# Altium schematic sheet 11 Proc Pwr1.SchDoc
size 420 x 297 mm
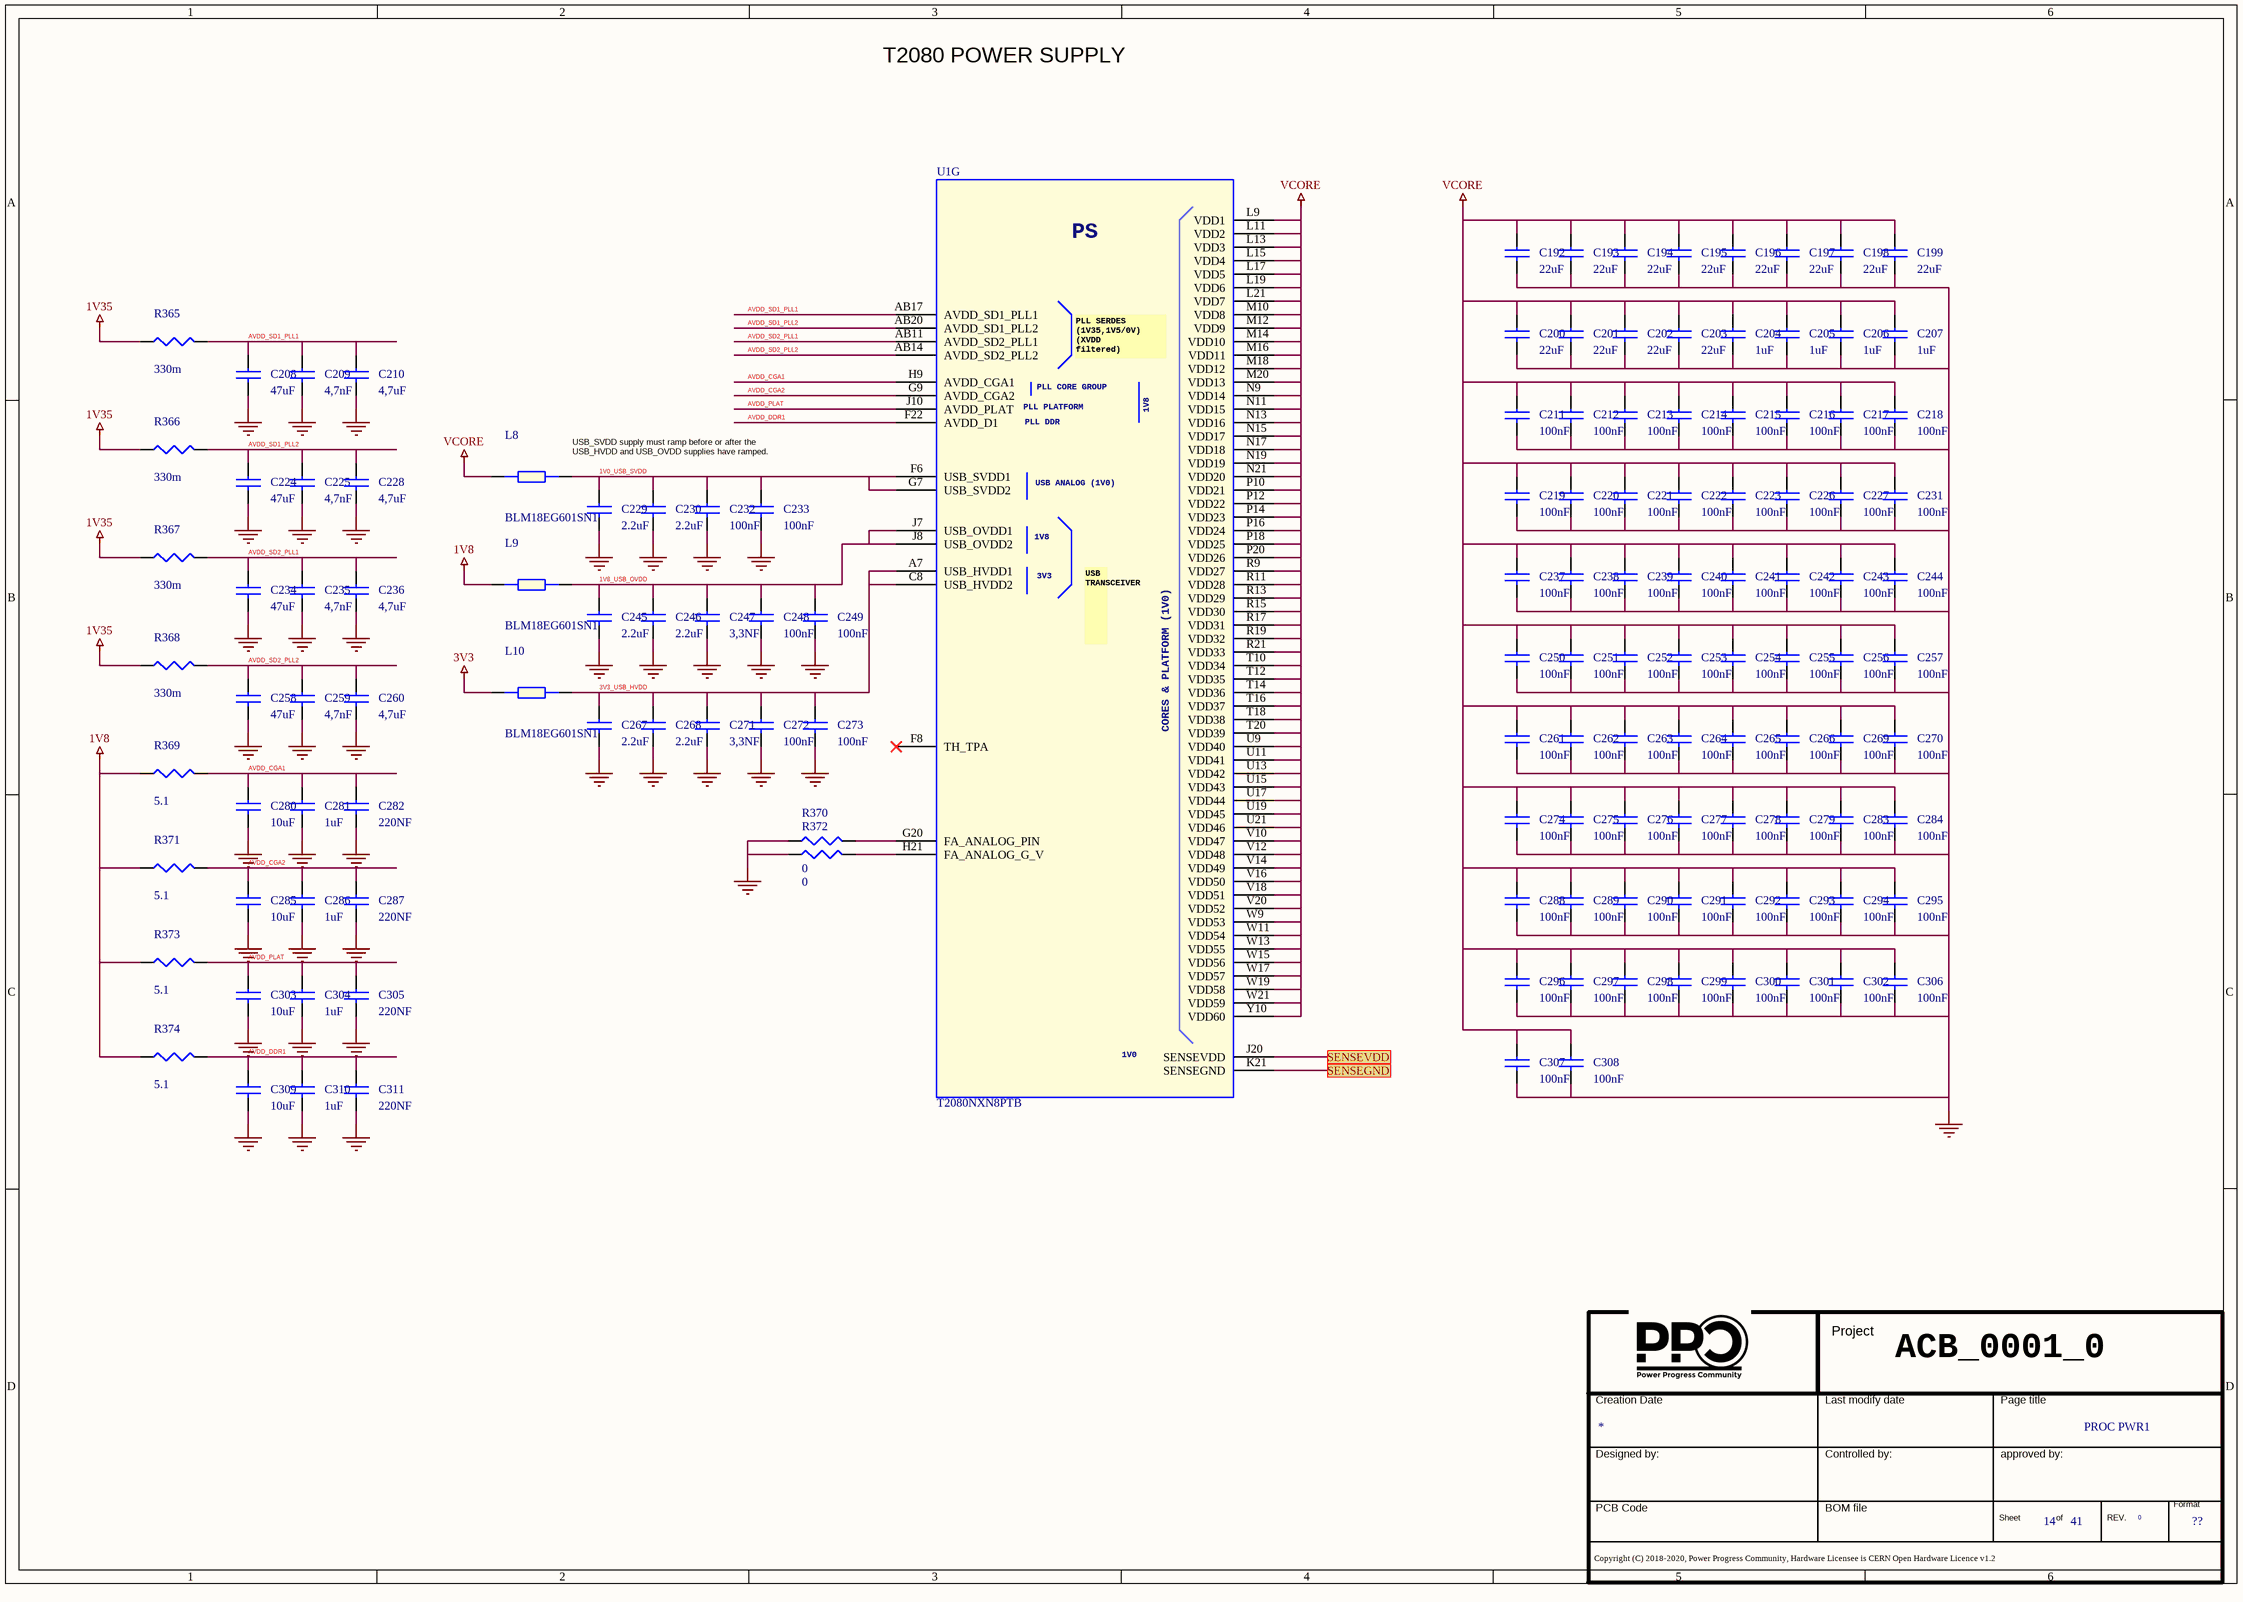
[diagram p0: 11 Proc Pwr1.SchDoc]

## Parts
*  Doc: PROC PWR1  Page Count: 41  Page Number: 14  Page Size: ??  RevCode: 0  (hidden comment: Title_block_PPC)  (graphical)
C192  22uF  [SMD_0805]
C193  22uF  [SMD_0805]
C194  22uF  [SMD_0805]
C195  22uF  [SMD_0805]
C196  22uF  [SMD_0805]
C197  22uF  [SMD_0805]
C198  22uF  [SMD_0805]
C199  22uF  [SMD_0805]
C200  22uF  [SMD_0805]
C201  22uF  [SMD_0805]
C202  22uF  [SMD_0805]
C203  22uF  [SMD_0805]
C204  1uF  [SMD_0402]
C205  1uF  [SMD_0402]
C206  1uF  [SMD_0402]
C207  1uF  [SMD_0402]
C208  47uF  [SMD_0805]
C209  4,7nF  [SMD_0402]
C210  4,7uF  [SMD_0603]
C211  100nF  [SMD_0603]
C212  100nF  [SMD_0603]
C213  100nF  [SMD_0201]
C214  100nF  [SMD_0603]
C215  100nF  [SMD_0603]
C216  100nF  [SMD_0603]
C217  100nF  [SMD_0603]
C218  100nF  [SMD_0603]
C219  100nF  [SMD_0201]
C220  100nF  [SMD_0201]
C221  100nF  [SMD_0603]
C222  100nF  [SMD_0201]
C223  100nF  [SMD_0201]
C224  47uF  [SMD_0805]
C225  4,7nF  [SMD_0402]
C226  100nF  [SMD_0603]
C227  100nF  [SMD_0603]
C228  4,7uF  [SMD_0603]
C229  2.2uF  [SMD_0402]
C230  2.2uF  [SMD_0402]
C231  100nF  [SMD_0603]
C232  100nF  [SMD_0603]
C233  100nF  [SMD_0603]
C234  47uF  [SMD_0805]
C235  4,7nF  [SMD_0402]
C236  4,7uF  [SMD_0603]
C237  100nF  [SMD_0201]
C238  100nF  [SMD_0201]
C239  100nF  [SMD_0201]
C240  100nF  [SMD_0201]
C241  100nF  [SMD_0201]
C242  100nF  [SMD_0201]
C243  100nF  [SMD_0201]
C244  100nF  [SMD_0201]
C245  2.2uF  [SMD_0402]
C246  2.2uF  [SMD_0402]
C247  3,3NF  [SMD_0402]
C248  100nF  [SMD_0603]
C249  100nF  [SMD_0603]
C250  100nF  [SMD_0201]
C251  100nF  [SMD_0201]
C252  100nF  [SMD_0201]
C253  100nF  [SMD_0201]
C254  100nF  [SMD_0201]
C255  100nF  [SMD_0201]
C256  100nF  [SMD_0201]
C257  100nF  [SMD_0201]
C258  47uF  [SMD_0805]
C259  4,7nF  [SMD_0402]
C260  4,7uF  [SMD_0603]
C261  100nF  [SMD_0201]
C262  100nF  [SMD_0201]
C263  100nF  [SMD_0201]
C264  100nF  [SMD_0201]
C265  100nF  [SMD_0201]
C266  100nF  [SMD_0201]
C267  2.2uF  [SMD_0402]
C268  2.2uF  [SMD_0402]
C269  100nF  [SMD_0201]
C270  100nF  [SMD_0201]
C271  3,3NF  [SMD_0402]
C272  100nF  [SMD_0603]
C273  100nF  [SMD_0603]
C274  100nF  [SMD_0201]
C275  100nF  [SMD_0201]
C276  100nF  [SMD_0201]
C277  100nF  [SMD_0201]
C278  100nF  [SMD_0201]
C279  100nF  [SMD_0201]
C280  10uF  [SMD_0603]
C281  1uF  [SMD_0402]
C282  220NF  [SMD_0402]
C283  100nF  [SMD_0201]
C284  100nF  [SMD_0201]
C285  10uF  [SMD_0603]
C286  1uF  [SMD_0402]
C287  220NF  [SMD_0402]
C288  100nF  [SMD_0201]
C289  100nF  [SMD_0201]
C290  100nF  [SMD_0201]
C291  100nF  [SMD_0201]
C292  100nF  [SMD_0201]
C293  100nF  [SMD_0201]
C294  100nF  [SMD_0201]
C295  100nF  [SMD_0201]
C296  100nF  [SMD_0201]
C297  100nF  [SMD_0201]
C298  100nF  [SMD_0201]
C299  100nF  [SMD_0201]
C300  100nF  [SMD_0201]
C301  100nF  [SMD_0201]
C302  100nF  [SMD_0201]
C303  10uF  [SMD_0603]
C304  1uF  [SMD_0402]
C305  220NF  [SMD_0402]
C306  100nF  [SMD_0201]
C307  100nF  [SMD_0201]
C308  100nF  [SMD_0201]
C309  10uF  [SMD_0603]
C310  1uF  [SMD_0402]
C311  220NF  [SMD_0402]
L8  BLM18EG601SN1  [SMD_0603]
L9  BLM18EG601SN1  [SMD_0603]
L10  BLM18EG601SN1  [SMD_0603]
R365  330m  [SMD_0402]
R366  330m  [SMD_0402]
R367  330m  [SMD_0402]
R368  330m  [SMD_0402]
R369  5.1  [SMD_0402]
R370  0  [SMD_0402]
R371  5.1  [SMD_0402]
R372  0  [SMD_0402]
R373  5.1  [SMD_0402]
R374  5.1  [SMD_0402]
U1  T2080NXN8PTB  [bga]  (part G of 14)

## Ports
SENSEGND, SENSEVDD

## Nets
1V8: L9.1 R369.1 R371.1 R373.1 R374.1
1V35: R365.1 R366.1 R367.1 R368.1
3V3: L10.1
GND: C192.2 C193.2 C194.2 C195.2 C196.2 C197.2 C198.2 C199.2 C200.2 C201.2 C202.2 C203.2 C204.2 C205.2 C206.2 C207.2 C208.2 C209.2 C210.2 C211.2 C212.2 C213.2 C214.2 C215.2 C216.2 C217.2 C218.2 C219.2 C220.2 C221.2 C222.2 C223.2 C224.2 C225.2 C226.2 C227.2 C228.2 C229.2 C230.2 C231.2 C232.2 C233.2 C234.2 C235.2 C236.2 C237.2 C238.2 C239.2 C240.2 C241.2 C242.2 C243.2 C244.2 C245.2 C246.2 C247.2 C248.2 C249.2 C250.2 C251.2 C252.2 C253.2 C254.2 C255.2 C256.2 C257.2 C258.2 C259.2 C260.2 C261.2 C262.2 C263.2 C264.2 C265.2 C266.2 C267.2 C268.2 C269.2 C270.2 C271.2 C272.2 C273.2 C274.2 C275.2 C276.2 C277.2 C278.2 C279.2 C280.2 C281.2 C282.2 C283.2 C284.2 C285.2 C286.2 C287.2 C288.2 C289.2 C290.2 C291.2 C292.2 C293.2 C294.2 C295.2 C296.2 C297.2 C298.2 C299.2 C300.2 C301.2 C302.2 C303.2 C304.2 C305.2 C306.2 C307.2 C308.2 C309.2 C310.2 C311.2 R370.1 R372.1
VCORE: C192.1 C193.1 C194.1 C195.1 C196.1 C197.1 C198.1 C199.1 C200.1 C201.1 C202.1 C203.1 C204.1 C205.1 C206.1 C207.1 C211.1 C212.1 C213.1 C214.1 C215.1 C216.1 C217.1 C218.1 C219.1 C220.1 C221.1 C222.1 C223.1 C226.1 C227.1 C231.1 C237.1 C238.1 C239.1 C240.1 C241.1 C242.1 C243.1 C244.1 C250.1 C251.1 C252.1 C253.1 C254.1 C255.1 C256.1 C257.1 C261.1 C262.1 C263.1 C264.1 C265.1 C266.1 C269.1 C270.1 C274.1 C275.1 C276.1 C277.1 C278.1 C279.1 C283.1 C284.1 C288.1 C289.1 C290.1 C291.1 C292.1 C293.1 C294.1 C295.1 C296.1 C297.1 C298.1 C299.1 C300.1 C301.1 C302.1 C306.1 C307.1 C308.1 L8.1 U1.L9(VDD1) U1.L11(VDD2) U1.L13(VDD3) U1.L15(VDD4) U1.L17(VDD5) U1.L19(VDD6) U1.L21(VDD7) U1.M10(VDD8) U1.M12(VDD9) U1.M14(VDD10) U1.M16(VDD11) U1.M18(VDD12) U1.M20(VDD13) U1.N9(VDD14) U1.N11(VDD15) U1.N13(VDD16) U1.N15(VDD17) U1.N17(VDD18) U1.N19(VDD19) U1.N21(VDD20) U1.P10(VDD21) U1.P12(VDD22) U1.P14(VDD23) U1.P16(VDD24) U1.P18(VDD25) U1.P20(VDD26) U1.R9(VDD27) U1.R11(VDD28) U1.R13(VDD29) U1.R15(VDD30) U1.R17(VDD31) U1.R19(VDD32) U1.R21(VDD33) U1.T10(VDD34) U1.T12(VDD35) U1.T14(VDD36) U1.T16(VDD37) U1.T18(VDD38) U1.T20(VDD39) U1.U9(VDD40) U1.U11(VDD41) U1.U13(VDD42) U1.U15(VDD43) U1.U17(VDD44) U1.U19(VDD45) U1.U21(VDD46) U1.V10(VDD47) U1.V12(VDD48) U1.V14(VDD49) U1.V16(VDD50) U1.V18(VDD51) U1.V20(VDD52) U1.W9(VDD53) U1.W11(VDD54) U1.W13(VDD55) U1.W15(VDD56) U1.W17(VDD57) U1.W19(VDD58) U1.W21(VDD59) U1.Y10(VDD60)
1V0_USB_SVDD: C229.1 C230.1 C232.1 C233.1 L8.2 U1.F6(USB_SVDD1) U1.G7(USB_SVDD2)
1V8_USB_OVDD: C245.1 C246.1 C247.1 C248.1 C249.1 L9.2 U1.J7(USB_OVDD1) U1.J8(USB_OVDD2)
3V3_USB_HVDD: C267.1 C268.1 C271.1 C272.1 C273.1 L10.2 U1.A7(USB_HVDD1) U1.C8(USB_HVDD2)
AVDD_CGA1: C280.1 C281.1 C282.1 R369.2 U1.H9(AVDD_CGA1)
AVDD_CGA2: C285.1 C286.1 C287.1 R371.2 U1.G9(AVDD_CGA2)
AVDD_DDR1: C309.1 C310.1 C311.1 R374.2 U1.F22(AVDD_D1)
AVDD_PLAT: C303.1 C304.1 C305.1 R373.2 U1.J10(AVDD_PLAT)
AVDD_SD1_PLL1: C208.1 C209.1 C210.1 R365.2 U1.AB17(AVDD_SD1_PLL1)
AVDD_SD1_PLL2: C224.1 C225.1 C228.1 R366.2 U1.AB20(AVDD_SD1_PLL2)
AVDD_SD2_PLL1: C234.1 C235.1 C236.1 R367.2 U1.AB11(AVDD_SD2_PLL1)
AVDD_SD2_PLL2: C258.1 C259.1 C260.1 R368.2 U1.AB14(AVDD_SD2_PLL2)
SENSEGND: U1.K21(SENSEGND) ; port SENSEGND
SENSEVDD: U1.J20(SENSEVDD) ; port SENSEVDD
NetR370_2: R370.2 U1.G20(FA_ANALOG_PIN)
NetR372_2: R372.2 U1.H21(FA_ANALOG_G_V)

Not connected (* = marked no-connect by the designer): U1 F8(TH_TPA)*

## Notes on the sheet
- T2080 POWER SUPPLY
- (near L8) USB_SVDD supply must ramp before or after the
  USB_HVDD and USB_OVDD supplies have ramped.
- ACB_0001_0
- (in symbol T2080, part G) PS; PLL SERDES / (1V35,1V5/0V) / (XVDD / filtered); PLL CORE GROUP; PLL PLATFORM; 1V8; PLL DDR; USB ANALOG (1V0); 3V3; USB / TRANSCEIVER; CORES & PLATFORM (1V0); 1V0
- (in symbol Title_block_PPC) Project; Creation Date; Last modify date; Page title; Designed by:; Controlled by:; approved by:; Format; PCB Code; BOM file; Sheet; of; REV.; Copyright (C) 2018-2020, Power Progress Community, Hardware Licensee is CERN Open Hardware Licence v1.2

## Library data of the parts
* = Title_block_PPC: Title: T2080PCIe; Schematic Page Count: 45; Schematic Page Number: 16; Author: MICETEK; Page Create Date: March  8, 1995; Page Title: ?; Page Modify Date: *
C192-C203 = CAP NP_Dup2: 22UF 35V 20% 0805; Manufacturer Part Number 1: C2012X5R1V226M125AC; Manufacturer 1: TDK; Part Number: PASSIVE_224; RSM: RC0805; PCB Footprint: SMD_0805; Part Type: Capacitors\Ceramic\SMD\0805
C204-C207 C281 C286 C304 C310 = CAP NP_Dup2: CAP CER 1UF 25V X6S 0402; Manufacturer Part Number 1: GRM155C81E105KE11D; Manufacturer 1: Murata; Part Number: PASSIVE_1446; RSM: RC0402; PCB Footprint: SMD_0402; Part Type: Capacitors\Ceramic\SMD\0402
C208 C224 C234 C258 = CAP NP_Dup2: CAP CER 47UF 10V 20% X5R 0805; Manufacturer Part Number 1: JMK212BJ476MG-T; Manufacturer 1: Taiyo Yuden; Part Number: PASSIVE_244; RSM: RC0805; PCB Footprint: SMD_0805; Part Type: Capacitors\Ceramic\SMD\0805
C209 C225 C235 C259 = CAP NP_Dup2: COND.CER. 4,7nF 50V 0402 X7R SMD; Manufacturer Part Number 1: GRM155R71H472KA01D; Manufacturer 1: Murata; Part Number: PASSIVE_78; RSM: RC0402; PCB Footprint: SMD_0402; Part Type: Capacitors\Ceramic\SMD\0402
C210 C228 C236 C260 = CAP NP_Dup2: COND.CER.4,7uF 16V X5R 0603 SMD; Manufacturer Part Number 1: CL10A475KO8NNNC; Manufacturer 1: SAMSUNG; Part Number: PASSIVE_1405; RSM: RC0603; PCB Footprint: SMD_0603; Part Type: Capacitors\Ceramic\SMD\0603
C211 C212 C214-C218 C221 C226 C227 C231-C233 C248 C249 C272 C273 = CAP NP_Dup2: COND.CER.100NF 50V 0603 X7R SMD; Manufacturer Part Number 1: ECJ1VB1H104K; Manufacturer 1: PANASONIC; Part Number: PASSIVE_118; RSM: RC0603; PCB Footprint: SMD_0603; Part Type: Capacitors\Ceramic\SMD\0603
C213 C219 C220 C237-C244 C253-C257 C261-C266 C269 C270 = CAP NP_Dup2: CAP CER 0.1UF 6.3V 20% X5R 0201; Manufacturer Part Number 1: C0603X5R0J104M030BC; Manufacturer 1: TDK; Part Number: PASSIVE_3; RSM: RC0201; PCB Footprint: SMD_0201; Part Type: Capacitors\Ceramic\SMD\0201
C222 C223 C250-C252 C274-C279 C283 C284 C288-C302 C306-C308 = CAP NP_Dup2: LCC - SMD/SMT 0201 0.1uF 10volts X7S +/-10%; Part Number: PASSIVE_2; Manufacturer 1: TDK; Manufacturer Part Number 1: C0603X7S1A104K030BC; RSM: RC0201; Part Type: Capacitors\Ceramic\SMD\0201; PCB Footprint: SMD_0201
C229 C230 C245 C246 C267 C268 = CAP NP_Dup2: CAP CER 2.2UF 25V X5R 0402; Manufacturer Part Number 1: GRM155R61E225ME15D; Manufacturer 1: Murata; Part Number: PASSIVE_1448; RSM: RC0402; PCB Footprint: SMD_0402; Part Type: Capacitors\Ceramic\SMD\0402
C247 C271 = CAP NP_Dup2: COND.CER. 3,3NF 50V 0402 X7R SMD; Part Number: PASSIVE_69; RSM: RC0402; PCB Footprint: SMD_0402; Part Type: Capacitors\Ceramic\SMD\0402
C280 C285 C303 C309 = CAP NP_Dup2: COND.CER.10uF 0603 25V SMD; Manufacturer Part Number 1: CL10A106MA8NRNC; Manufacturer 1: SAMSUNG; Part Number: PASSIVE_124; RSM: RC0603; PCB Footprint: SMD_0603; Part Type: Capacitors\Ceramic\SMD\0603
C282 C287 C305 C311 = CAP NP_Dup2: COND.CER. 220NF 10V 0402 X7R SMD; Part Number: PASSIVE_59; Manufacturer 1: Murata; Manufacturer Part Number 1: GRM155R61A224KE19; RSM: RC0402; Part Type: Capacitors\Ceramic\SMD\0402; PCB Footprint: SMD_0402
L8-L10 = FERRITE_BEAD: FERRITE BEAD 600ohm 500mA 0603 SMD; Part Number: PASSIVE_377; Manufacturer 1: Murata; Manufacturer Part Number 1: BLM18EG601SN1 SMD; RSM: RC0603; PCB Footprint: SMD_0603; Part Type: Ferrite Beads\SMD\0603
R365-R368 = R_Dup5: Resistori rilevatori di corrente - SMD 1/8watt .33ohms 1%; Manufacturer Part Number 1: RCWE0402R330FKEA; Manufacturer 1: VISHAY DALE; Part Number: PASSIVE_1464; RSM: RC0402; PCB Footprint: SMD_0402; Part Type: Resistors\Fixed\SMD\0603\1%
R369 R371 R373 R374 = R_Dup5: RESIS.CHIP 5,1 1% 0402 SMD; Part Number: PASSIVE_747; Manufacturer 1: YAGEO; Manufacturer Part Number 1: RES SMD 5.1 OHM 1% 1/16W 0402; RSM: RC0402; PCB Footprint: SMD_0402; Part Type: Resistors\Fixed\SMD\0402\1%
R370 R372 = R_Dup5: RESIS.CHIP 0R 5% 0402 SMD; Part Number: PASSIVE_805; Manufacturer 1: ROYAL OHM; RSM: RC0402; PCB Footprint: SMD_0402; Part Type: Resistors\Fixed\SMD\0402\5%; Manufacturer Part Number 1: RESIS.CHIP 0R 5% 0402 SMD
U1 = T2080: QRIQ MPU 1.87GT/s DDR3/3L 4x10GE; Part Number: MICROPROCESSOR_65; Manufacturer 1: NXP; Vendor: Freescale; PCB Footprint: BGA896; RSM: PBGA896-0_8MM-25X25; TYPE: IC; MPN: T2080; Part Type: 32 BIT; Manufacturer Part Number 1: T2080NXN8PTB; Distributor 1: MOUSER(841-T2080NXN8PTB)